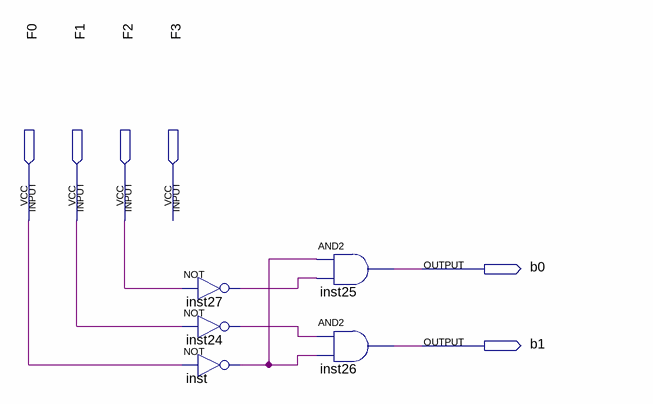
[diagram p0: schematic sheet]
// Quartus schematic No3.bdf as structural Verilog: 5 symbols, 6 pins
module No3 (
  input  F0,
  input  F1,
  input  F2,
  input  F3,
  output b0,
  output b1
);

  wire inst24_out, inst27_out, inst_out;

  not inst27 (inst27_out, F2);
  not inst24 (inst24_out, F1);
  not inst (inst_out, F0);
  and inst25 (b0, inst_out, inst27_out);
  and inst26 (b1, inst24_out, inst_out);
endmodule
